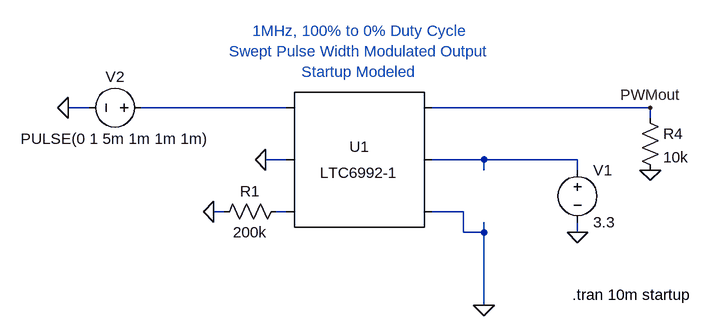
[diagram p0: schematic LT6992-1.asc]
LT6992-1.asc, the LTspice schematic file:
Version 4
SHEET 1 996 680
WIRE -208 96 -240 96
WIRE 96 96 -128 96
WIRE 656 96 320 96
WIRE 656 112 656 96
WIRE 96 176 64 176
WIRE 400 176 320 176
WIRE 544 176 400 176
WIRE 400 192 400 176
WIRE 544 192 544 176
WIRE 0 256 -16 256
WIRE 96 256 80 256
WIRE 368 256 320 256
WIRE 368 288 368 256
WIRE 400 288 400 272
WIRE 400 288 368 288
WIRE 544 288 544 272
WIRE 400 400 400 288
FLAG -240 96 0
FLAG 544 288 0
FLAG 656 96 PWMout
FLAG 400 400 0
FLAG -16 256 0
FLAG 64 176 0
FLAG 656 192 0
SYMBOL res 96 240 R90
WINDOW 0 0 56 VBottom 2
WINDOW 3 32 56 VTop 2
SYMATTR InstName R1
SYMATTR Value 200k
SYMBOL voltage 544 176 R0
WINDOW 123 0 0 Left 2
WINDOW 39 0 0 Left 2
SYMATTR InstName V1
SYMATTR Value 3.3
SYMBOL voltage -112 96 R90
WINDOW 123 74 56 VTop 2
WINDOW 39 53 56 VTop 2
WINDOW 3 32 56 VTop 2
WINDOW 0 -32 56 VBottom 2
SYMATTR Value PULSE(0 1 5m 1m 1m 1m)
SYMATTR InstName V2
SYMBOL SpecialFunctions\\LTC6992-1 208 176 R0
SYMATTR InstName U1
SYMBOL res 640 96 R0
SYMATTR InstName R4
SYMATTR Value 10k
TEXT 536 384 Left 2 !.tran 10m startup
TEXT 208 56 Bottom 2 ;1MHz, 100% to 0% Duty Cycle\nSwept Pulse Width Modulated Output\nStartup Modeled

The netlist it stands for:
* LT6992-1.asc
R1 N003 0 200k
V1 N002 0 3.3
V2 N001 0 PULSE(0 1 5m 1m 1m 1m)
XU1 N001 0 N003 0 N002 PWMout LTC6992-1
R4 PWMout 0 10k
.tran 10m startup
* 1MHz, 100% to 0% Duty Cycle
* Swept Pulse Width Modulated Output
* Startup Modeled
.lib LTC6992-1.sub
.backanno
.end